# Altium schematic sheet VoltageSensorInput.SchDoc
size 219 x 180 mm; SheetNumber: 6; SheetTotal: 7; ENG_APP_DATE: --/--/--; DSN_APP_DATE: --/--/--; CHK_APP_DATE: --/--/--
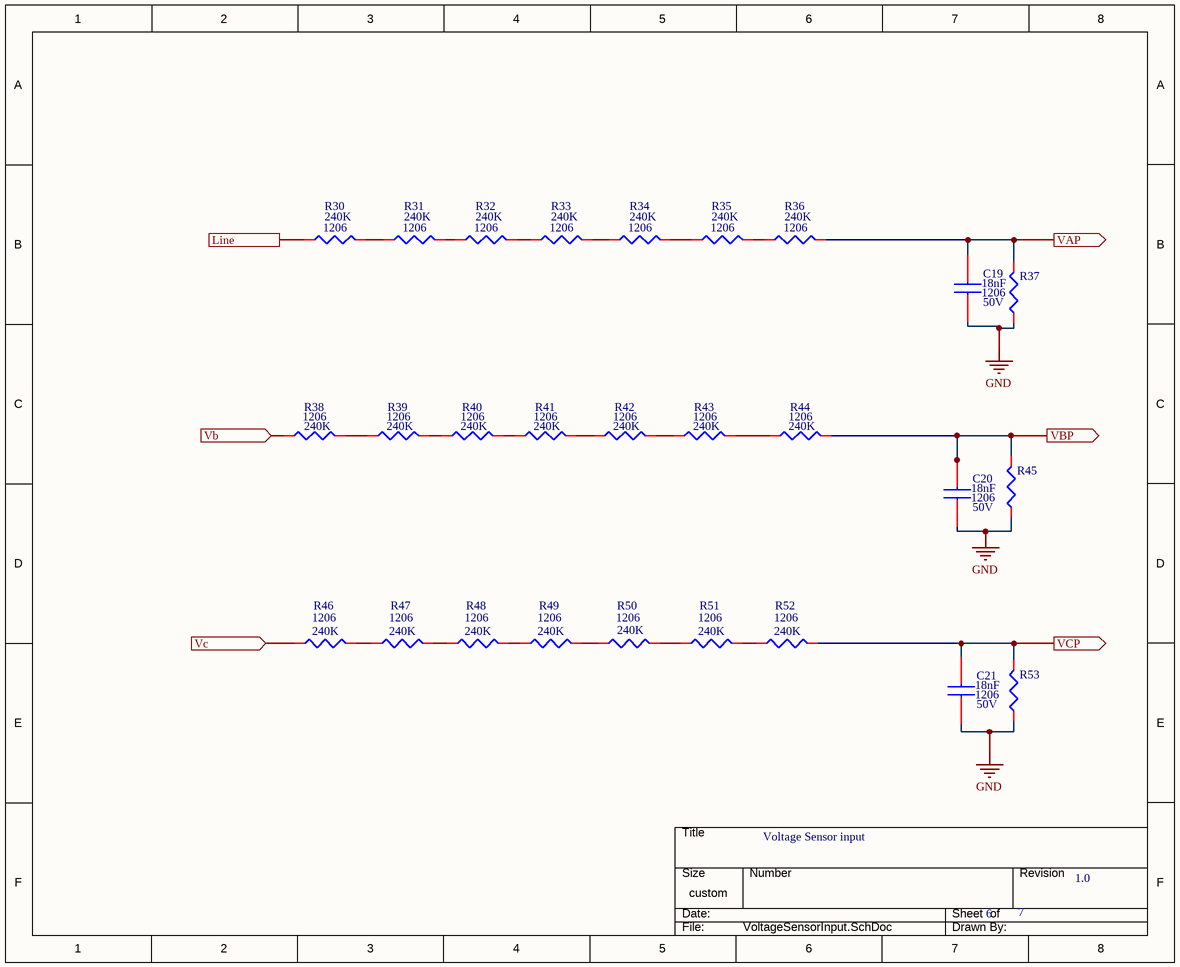
[diagram p0: VoltageSensorInput.SchDoc]

## Parts
C19  Size: 1206  Capacitance: 18nF  Voltage: 50V  [CAPC3316X180N]  (hidden comment: C1206C183J5RACTU)
C20  Size: 1206  Capacitance: 18nF  Voltage: 50V  [CAPC3316X180N]  (hidden comment: C1206C183J5RACTU)
C21  Size: 1206  Capacitance: 18nF  Voltage: 50V  [CAPC3316X180N]  (hidden comment: C1206C183J5RACTU)
R30  Size: 1206  Resistance: 240K  [RESC3216X70N]  (hidden comment: ERA-8AEB244V)
R31  Size: 1206  Resistance: 240K  [RESC3216X70N]  (hidden comment: ERA-8AEB244V)
R32  Size: 1206  Resistance: 240K  [RESC3216X70N]  (hidden comment: ERA-8AEB244V)
R33  Size: 1206  Resistance: 240K  [RESC3216X70N]  (hidden comment: ERA-8AEB244V)
R34  Size: 1206  Resistance: 240K  [RESC3216X70N]  (hidden comment: ERA-8AEB244V)
R35  Size: 1206  Resistance: 240K  [RESC3216X70N]  (hidden comment: ERA-8AEB244V)
R36  Size: 1206  Resistance: 240K  [RESC3216X70N]  (hidden comment: ERA-8AEB244V)
R37  ERA-6AED102V  [RESC2013X84N]  (value not drawn)
R38  Size: 1206  Resistance: 240K  [RESC3216X70N]  (hidden comment: ERA-8AEB244V)
R39  Size: 1206  Resistance: 240K  [RESC3216X70N]  (hidden comment: ERA-8AEB244V)
R40  Size: 1206  Resistance: 240K  [RESC3216X70N]  (hidden comment: ERA-8AEB244V)
R41  Size: 1206  Resistance: 240K  [RESC3216X70N]  (hidden comment: ERA-8AEB244V)
R42  Size: 1206  Resistance: 240K  [RESC3216X70N]  (hidden comment: ERA-8AEB244V)
R43  Size: 1206  Resistance: 240K  [RESC3216X70N]  (hidden comment: ERA-8AEB244V)
R44  Size: 1206  Resistance: 240K  [RESC3216X70N]  (hidden comment: ERA-8AEB244V)
R45  ERA-6AED102V  [RESC2013X84N]  (value not drawn)
R46  Size: 1206  Resistance: 240K  [RESC3216X70N]  (hidden comment: ERA-8AEB244V)
R47  Size: 1206  Resistance: 240K  [RESC3216X70N]  (hidden comment: ERA-8AEB244V)
R48  Size: 1206  Resistance: 240K  [RESC3216X70N]  (hidden comment: ERA-8AEB244V)
R49  Size: 1206  Resistance: 240K  [RESC3216X70N]  (hidden comment: ERA-8AEB244V)
R50  Size: 1206  Resistance: 240K  [RESC3216X70N]  (hidden comment: ERA-8AEB244V)
R51  Size: 1206  Resistance: 240K  [RESC3216X70N]  (hidden comment: ERA-8AEB244V)
R52  Size: 1206  Resistance: 240K  [RESC3216X70N]  (hidden comment: ERA-8AEB244V)
R53  ERA-6AED102V  [RESC2013X84N]  (value not drawn)

## Ports
Line (see Main[3B], PowerSupply[4C], VoltageIn[4E]), VAP (out, see Main[3B], MeteringIC[5C]), Vb (in, see Main[3B], VoltageIn[4C]), VBP (out, see Main[3B], MeteringIC[5C]), Vc (in, see Main[3B], VoltageIn[4C]), VCP (out, see Main[3B], MeteringIC[5D])

## Nets
GND: C19.2 C20.2 C21.2 R37.2 R45.2 R53.2
Line: R30.2 ; port Line
VAP: C19.1 R36.1 R37.1 ; port VAP
Vb: R38.2 ; port Vb
VBP: C20.1 R44.1 R45.1 ; port VBP
Vc: R46.2 ; port Vc
VCP: C21.1 R52.1 R53.1 ; port VCP
NetR30_1: R30.1 R31.2
NetR31_1: R31.1 R32.2
NetR32_1: R32.1 R33.2
NetR33_1: R33.1 R34.2
NetR34_1: R34.1 R35.2
NetR35_1: R35.1 R36.2
NetR38_1: R38.1 R39.2
NetR39_1: R39.1 R40.2
NetR40_1: R40.1 R41.2
NetR41_1: R41.1 R42.2
NetR42_1: R42.1 R43.2
NetR43_1: R43.1 R44.2
NetR46_1: R46.1 R47.2
NetR47_1: R47.1 R48.2
NetR48_1: R48.1 R49.2
NetR49_1: R49.1 R50.2
NetR50_1: R50.1 R51.2
NetR51_1: R51.1 R52.2

## Notes on the sheet
- Voltage Sensor input
- 6
- 7
- 1.0
- DWG. NO.
- REV.
- SHT.
- THIS DOCUMENT AND THE DATA DISCLOSED HEREIN OR HEREWITH IS THE PROPERTY OF ALTIUM LIMITED AND MAY BE FREELY DISTRIBUTED IN WHOLE. NO RIGHTS ARE RESERVED OR EXPRESS OR IMPLIED WARANTEE GIVEN.
- REVISION
- DESCRIPTION
- DATE
- APPROVED
- ENG:
- APPROVALS
- PROJECT
- DSN:
- CHK:
- REFERENCE DOCUMENTS
- PROJECT REVISION:
- TITLE
- DOCUMENT REVISION:
- DESIGN ITEM:
- BOM:
- FAB DWG:
- PCB DWG:
- ASSY DWG:
- SCALE:
- SIZE
- B
- CAGE CODE
- FILE NAME
- DWG NO.
- SHEET
- OF
- REV

## Library data of the parts
C19-C21 = C1206X224KARACAUTO: Multilayer Ceramic Capacitors MLCC - SMD/SMT 50V 0.018uF X7R 1206 5%; Manufacturer_Name: KEMET; Geometry.Height: 1.8mm; Mouser Part Number: 80-C1206X224KARAUTO; Mouser Price/Stock: https://www.mouser.co.uk/ProductDetail/KEMET/C1206X224KARACAUTO?qs=zW32dvEIR3ul9TqTUrs40g%3D%3D; Manufacturer_Part_Number: C1206X224KARACAUTO; Datasheet Link: https://search.kemet.com/component-documentation/download/specsheet/C1206X224KARACAUTO
R30-R36 R38-R44 R46-R52 = ERA-8AEB244V: Thin Film Resistors - SMD 1206 240Kohm 0.1% 25ppm; Manufacturer_Name: Panasonic; Geometry.Height: 0.7mm; Mouser Part Number: 667-ERA-8AEB244V; Mouser Price/Stock: https://www.mouser.com/Search/Refine.aspx?Keyword=667-ERA-8AEB244V; Manufacturer_Part_Number: ERA-8AEB244V; Datasheet Link: https://componentsearchengine.com/Datasheets/1/ERA-8AEB244V.pdf
R37 R45 R53 = ERA-6AED102V: Thin Film Resistors - SMD 0805 1000ohms 25ppm 0.5% AEC-Q200; Manufacturer_Name: Panasonic; Geometry.Height: 0.6mm; Mouser Part Number: 667-ERA-6AED102V; Mouser Price/Stock: https://www.mouser.co.uk/ProductDetail/Panasonic/ERA-6AED102V?qs=MNPzkKEzRtTAvKH%252BuMqwyg%3D%3D; Manufacturer_Part_Number: ERA-6AED102V; Datasheet Link: https://industrial.panasonic.com/cdbs/www-data/pdf/RDM0000/AOA0000C307.pdf